# Altium project PWR_bipolar.PrjPcb
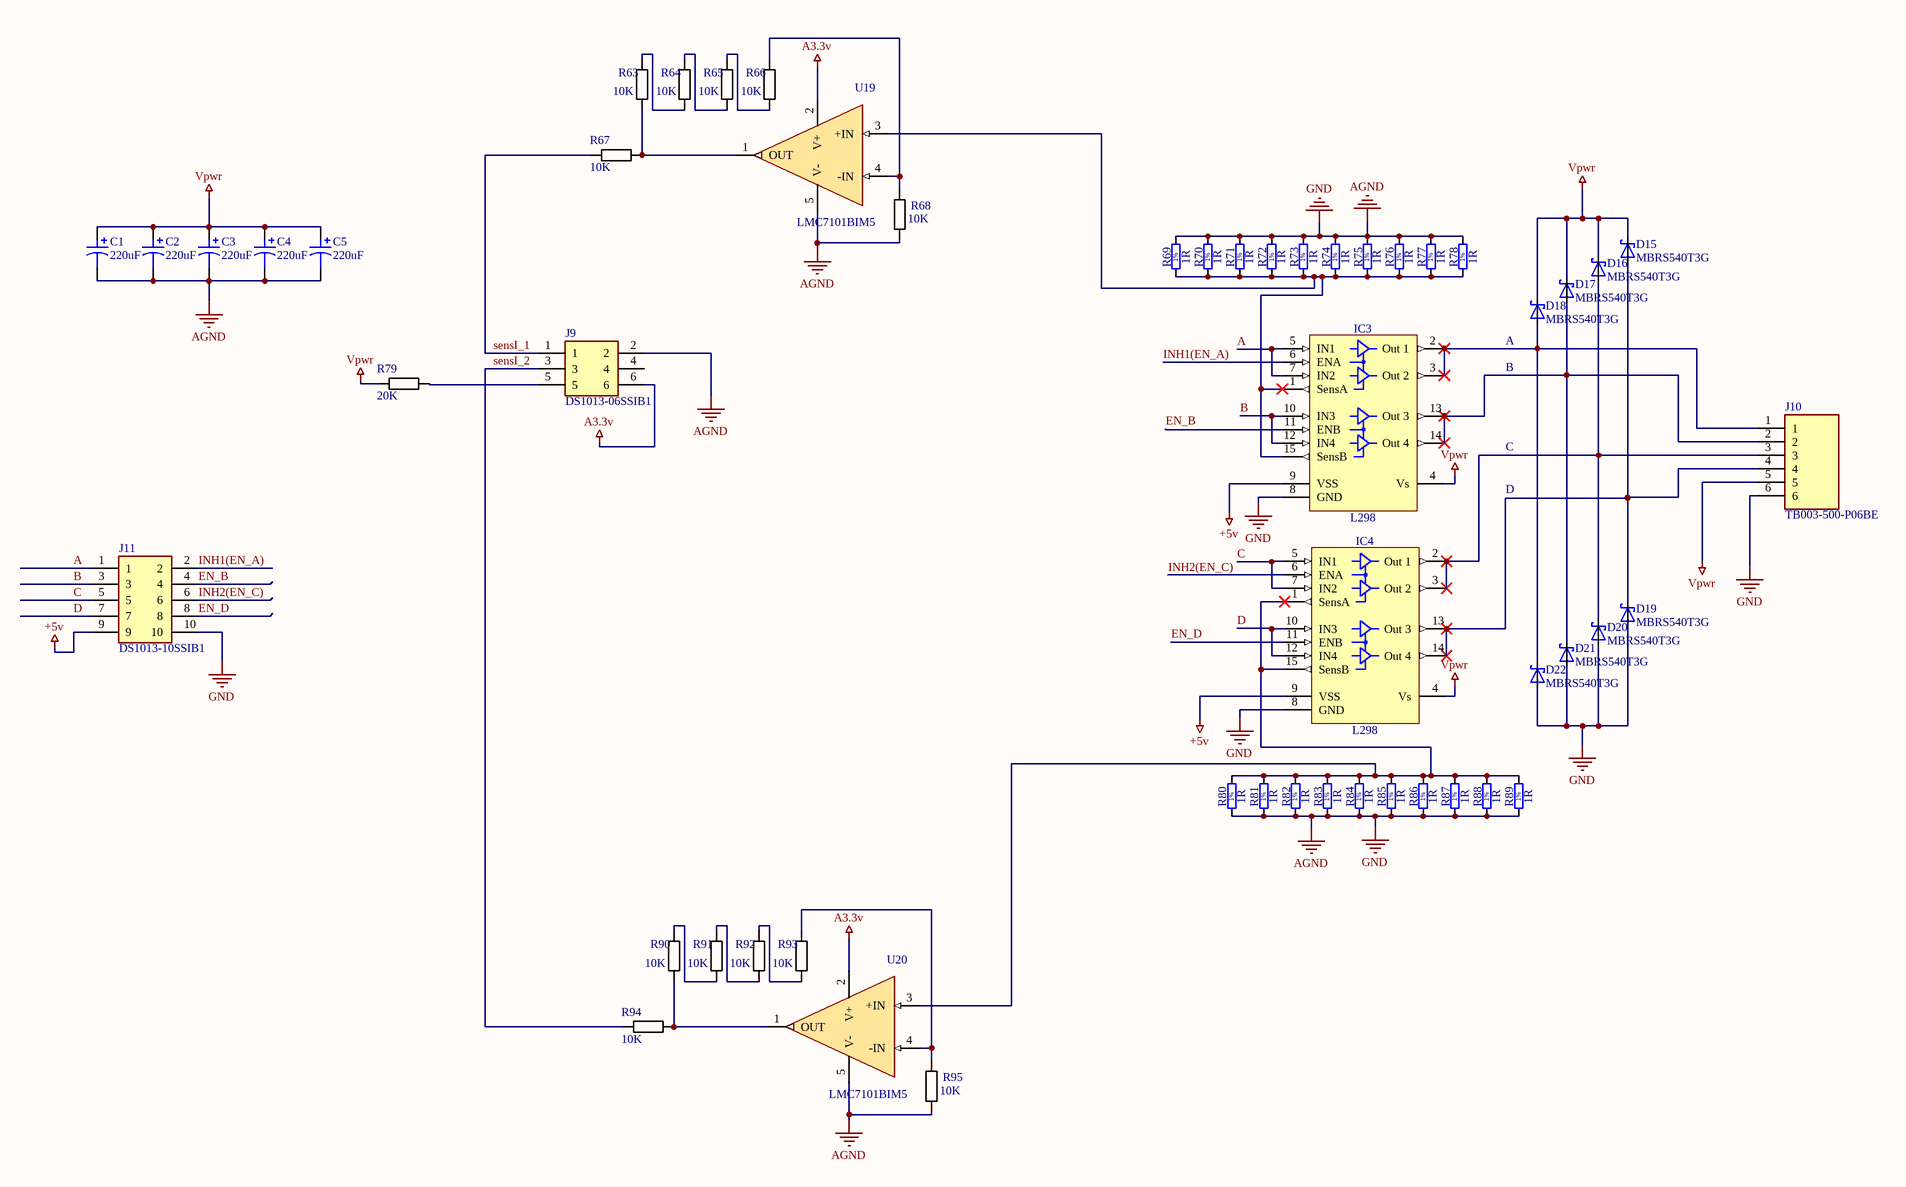
[diagram p0: PWR_bipol.SchDoc]
1 sheet, 53 parts. Net scope: global (net labels, ports and power ports of the same name join across sheets).
Board file: PWR_bopolar.PcbDoc

## Sheet PWR_bipol.SchDoc
size A2

### Parts
C1  value 220uF  [ECR 10x13mm]  (hidden comment: 220uF 50v)
C2  value 220uF  [ECR 10x13mm]  (hidden comment: 220uF 50v)
C3  value 220uF  [ECR 10x13mm]  (hidden comment: 220uF 50v)
C4  value 220uF  [ECR 10x13mm]  (hidden comment: 220uF 50v)
C5  value 220uF  [ECR 10x13mm]  (hidden comment: 220uF 50v)
D15  MBRS540T3G  [DIOM7958X213N]
D16  MBRS540T3G  [DIOM7958X213N]
D17  MBRS540T3G  [DIOM7958X213N]
D18  MBRS540T3G  [DIOM7958X213N]
D19  MBRS540T3G  [DIOM7958X213N]
D20  MBRS540T3G  [DIOM7958X213N]
D21  MBRS540T3G  [DIOM7958X213N]
D22  MBRS540T3G  [DIOM7958X213N]
IC3  L298  [MW-15]
IC4  L298  [MW-15]
J9  DS1013-06SSIB1  [CONNFLY_DS1013-06SSIB1]
J10  TB003-500-P06BE  [CUI_TB003-500-P06BE]
J11  DS1013-10SSIB1  [CONNFLY_DS1013-10SSIB1]
R63  10K  [Resistor 0805]
R64  10K  [Resistor 0805]
R65  10K  [Resistor 0805]
R66  10K  [Resistor 0805]
R67  10K  [Resistor 0805]
R68  10K  [Resistor 0805]
R69  1R  [R2512]
R70  1R  [R2512]
R71  1R  [R2512]
R72  1R  [R2512]
R73  1R  [R2512]
R74  1R  [R2512]
R75  1R  [R2512]
R76  1R  [R2512]
R77  1R  [R2512]
R78  1R  [R2512]
R79  20K  [Resistor 0805]
R80  1R  [R2512]
R81  1R  [R2512]
R82  1R  [R2512]
R83  1R  [R2512]
R84  1R  [R2512]
R85  1R  [R2512]
R86  1R  [R2512]
R87  1R  [R2512]
R88  1R  [R2512]
R89  1R  [R2512]
R90  10K  [Resistor 0805]
R91  10K  [Resistor 0805]
R92  10K  [Resistor 0805]
R93  10K  [Resistor 0805]
R94  10K  [Resistor 0805]
R95  10K  [Resistor 0805]
U19  LMC7101BIM5  [*SOT95P280X145-5N]
U20  LMC7101BIM5  [*SOT95P280X145-5N]

### Nets
+5v: IC3.9(VSS) IC4.9(VSS) J11.9
A3.3v: J9.6 U19.2(V+) U20.2(V+)
AGND: C1.2 C2.2 C3.2 C4.2 C5.2 D19.A D20.A D21.A D22.A IC3.8(GND) IC4.8(GND) J9.2 J10.6 J11.10 R68.1 R69.2 R70.2 R71.2 R72.2 R73.2 R74.2 R75.2 R76.2 R77.2 R78.2 R80.1 R81.1 R82.1 R83.1 R84.1 R85.1 R86.1 R87.1 R88.1 R89.1 R95.1 U19.5(V-) U20.5(V-)  [also labelled GND]
Vpwr: C1.1 C2.1 C3.1 C4.1 C5.1 D15.C D16.C D17.C D18.C IC3.4(Vs) IC4.4(Vs) J10.5 R79.1
A: IC3.5(IN1) IC3.7(IN2) J11.1
B: IC3.10(IN3) IC3.12(IN4) J11.3
C: IC4.5(IN1) IC4.7(IN2) J11.5
D: IC4.10(IN3) IC4.12(IN4) J11.7
EN_B: IC3.11(ENB) J11.4
EN_D: IC4.11(ENB) J11.8
INH1(EN_A): IC3.6(ENA) J11.2
INH2(EN_C): IC4.6(ENA) J11.6
sensI_1: J9.1 R67.1
sensI_2: J9.3 R94.1
NetD15_A: D15.A D19.C IC4.13(Out_3) IC4.14(Out_4) J10.4
NetD16_A: D16.A D20.C IC4.2(Out_1) IC4.3(Out_2) J10.3
NetD17_A: D17.A D21.C IC3.13(Out_3) IC3.14(Out_4) J10.2
NetD18_A: D18.A D22.C IC3.2(Out_1) IC3.3(Out_2) J10.1
NetIC3_1: IC3.1(SensA) IC3.15(SensB) R69.1 R70.1 R71.1 R72.1 R73.1 R74.1 R75.1 R76.1 R77.1 R78.1 U19.3(+IN)
NetIC4_1: IC4.1(SensA) IC4.15(SensB) R80.2 R81.2 R82.2 R83.2 R84.2 R85.2 R86.2 R87.2 R88.2 R89.2 U20.3(+IN)
NetJ9_5: J9.5 R79.2
NetR63_1: R63.1 R64.2
NetR63_2: R63.2 R67.2 U19.1(OUT)
NetR64_1: R64.1 R65.2
NetR65_1: R65.1 R66.2
NetR66_1: R66.1 R68.2 U19.4(-IN)
NetR90_1: R90.1 R91.2
NetR90_2: R90.2 R94.2 U20.1(OUT)
NetR91_1: R91.1 R92.2
NetR92_1: R92.1 R93.2
NetR93_1: R93.1 R95.2 U20.4(-IN)

Not connected (* = marked no-connect by the designer): J9 4

### Notes on the sheet
- (near D18) A
- B
- C
- D
- (in symbol Resistor - 1%) 1%

### Library data of the parts
C1-C5 = Cap Pol: Polarized Capacitor (Rad); Voltage: 50; Type: Type; URL: http://www.hitano.com.tw/PDF/ECR_081225.pdf
D15-D22 = MBRS540T3G: Diode Schottky 40V 5A Surface Mount SMC; MF: ON Semiconductor; SnapEDA_Link: https://www.snapeda.com/parts/MBRS540T3G/ON%20Semiconductor/view-part/78777/?ref=snap; MP: MBRS540T3G; Availability: Unavailable; Price: None; Value: *; Package: DO-214 ON Semiconductor
IC3 IC4 = L298N: Dual Full-Bridge Driver
J9 = DS1013-06SSIB1: Socket; IDC; male; PIN: 6; straight; THT; gold plated; 2.54mm
J10 = TB003-500-P06BE: 2~24 Poles, Screw Type, Horizontal, 5.0 Pitch, 26~14 _AWG_, Terminal Block Connector; MF: CUI Devices; Value: *; Price: None; MP: TB003-500-P06BE; SnapEDA_Link: https://www.snapeda.com/parts/TB003-500-P06BE/CUI%20Devices/view-part/3590657/?ref=snap; Package: None; Availability: Unavailable
J11 = DS1013-10SSIB1: Socket; IDC; male; PIN: 10; straight; THT; gold plated; 2.54mm; MF: Connfly; Availability: Unavailable; Price: None; Package: None; Value: *; SnapEDA_Link: https://www.snapeda.com/parts/DS1013-10SSIB1/Connfly/view-part/951223/?ref=snap; MP: DS1013-10SSIB1; BuyPart: https://www.snapeda.com/parts/DS1013-10SSIB1/Connfly/view-part/951223/?ref=eda
R63-R68 R79 R90-R95 = Resistor: Value: *
R69-R78 R80-R89 = Resistor - 1%
U19 U20 = LMC7101BIM5: Check_prices: https://www.snapeda.com/parts/LMC7101BIM5/Texas%20Instruments/view-part/19255/?ref=eda; SnapEDA_Link: https://www.snapeda.com/parts/LMC7101BIM5/Texas%20Instruments/view-part/19255/?ref=snap; Value: *